# EAGLE schematic FinalSchematic1.2 (EAGLE 9.6.2)

## Sheet 1 of 6: Microcontroller
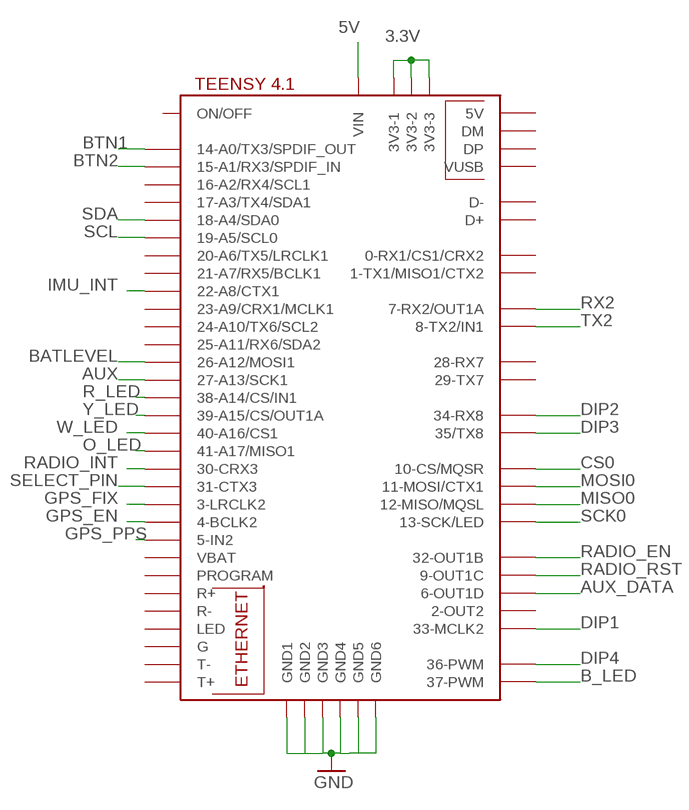
[diagram p0: schematic, sheet 1]

### Parts
TEENSY4.1  TEENSY41  [TEENSY41]

### Nets
3.3V: TEENSY4.1.3V3-1 TEENSY4.1.3V3-2 TEENSY4.1.3V3-3 ; also sheet 3
5V: TEENSY4.1.VIN ; also sheet 2,3,4,5,6
AUX: TEENSY4.1.27-A13/SCK1 ; also sheet 5
AUX_DATA: TEENSY4.1.6-OUT1D
B_LED: TEENSY4.1.37-PWM ; also sheet 5
BATLEVEL: TEENSY4.1.26-A12/MOSI1 ; also sheet 3
BTN1: TEENSY4.1.14-A0/TX3/SPDIF_OUT ; also sheet 5
BTN2: TEENSY4.1.15-A1/RX3/SPDIF_IN ; also sheet 5
CS0: TEENSY4.1.10-CS\MQSR(10-CS/MQSR) ; also sheet 4
DIP1: TEENSY4.1.33-MCLK2 ; also sheet 5
DIP2: TEENSY4.1.34-RX8 ; also sheet 5
DIP3: TEENSY4.1.35-TX8(35/TX8) ; also sheet 5
DIP4: TEENSY4.1.36-PWM ; also sheet 5
GND: TEENSY4.1.GND1 TEENSY4.1.GND2 TEENSY4.1.GND3 TEENSY4.1.GND4 TEENSY4.1.GND5 TEENSY4.1.GND6 ; also sheet 2,3,4,5
GPS_EN: TEENSY4.1.4-BCLK2 ; also sheet 4
GPS_FIX: TEENSY4.1.3-LRCLK2 ; also sheet 4
GPS_PPS: TEENSY4.1.5-IN2 ; also sheet 4
IMU_INT: TEENSY4.1.22-A8/CTX1 ; also sheet 4
MISO0: TEENSY4.1.12-MISO/MQSL ; also sheet 4
MOSI0: TEENSY4.1.11-MOSI/CTX1 ; also sheet 4
O_LED: TEENSY4.1.41-A17/MISO1 ; also sheet 5
R_LED: TEENSY4.1.38-A14/CS/IN1 ; also sheet 5
RADIO_EN: TEENSY4.1.32-OUT1B ; also sheet 4
RADIO_INT: TEENSY4.1.30-CRX3 ; also sheet 4
RADIO_RST: TEENSY4.1.9-OUT1C ; also sheet 4
RX2: TEENSY4.1.7-RX2/OUT1A ; also sheet 4
SCK0: TEENSY4.1.13-SCK/LED ; also sheet 4
SCL: TEENSY4.1.19-A5/SCL0 ; also sheet 2,4,5,6
SDA: TEENSY4.1.18-A4/SDA0 ; also sheet 2,4,5,6
SELECT_PIN: TEENSY4.1.31-CTX3 ; also sheet 5
TX2: TEENSY4.1.8-TX2/IN1 ; also sheet 4
W_LED: TEENSY4.1.40-A16/CS1 ; also sheet 5
Y_LED: TEENSY4.1.39-A15/CS/OUT1A ; also sheet 5
Unconnected: TEENSY4.1.0-RX1/CS1/CRX2 TEENSY4.1.1-TX1/MISO1/CTX2 TEENSY4.1.2-OUT2 TEENSY4.1.16-A2/RX4/SCL1 TEENSY4.1.17-A3/TX4/SDA1 TEENSY4.1.20-A6/TX5/LRCLK1 TEENSY4.1.21-A7/RX5/BCLK1 TEENSY4.1.23-A9/CRX1/MCLK1 TEENSY4.1.24-A10/TX6/SCL2 TEENSY4.1.25-A11/RX6/SDA2 TEENSY4.1.28-RX7 TEENSY4.1.29-TX7 TEENSY4.1.+5V(5V) TEENSY4.1.D+ TEENSY4.1.D- TEENSY4.1.DM TEENSY4.1.DP TEENSY4.1.G TEENSY4.1.LED TEENSY4.1.ON/OFF TEENSY4.1.PROGRAM TEENSY4.1.R+ TEENSY4.1.R- TEENSY4.1.T+ TEENSY4.1.T- TEENSY4.1.VBAT TEENSY4.1.VUSB

## Sheet 2 of 6: Servo Driver
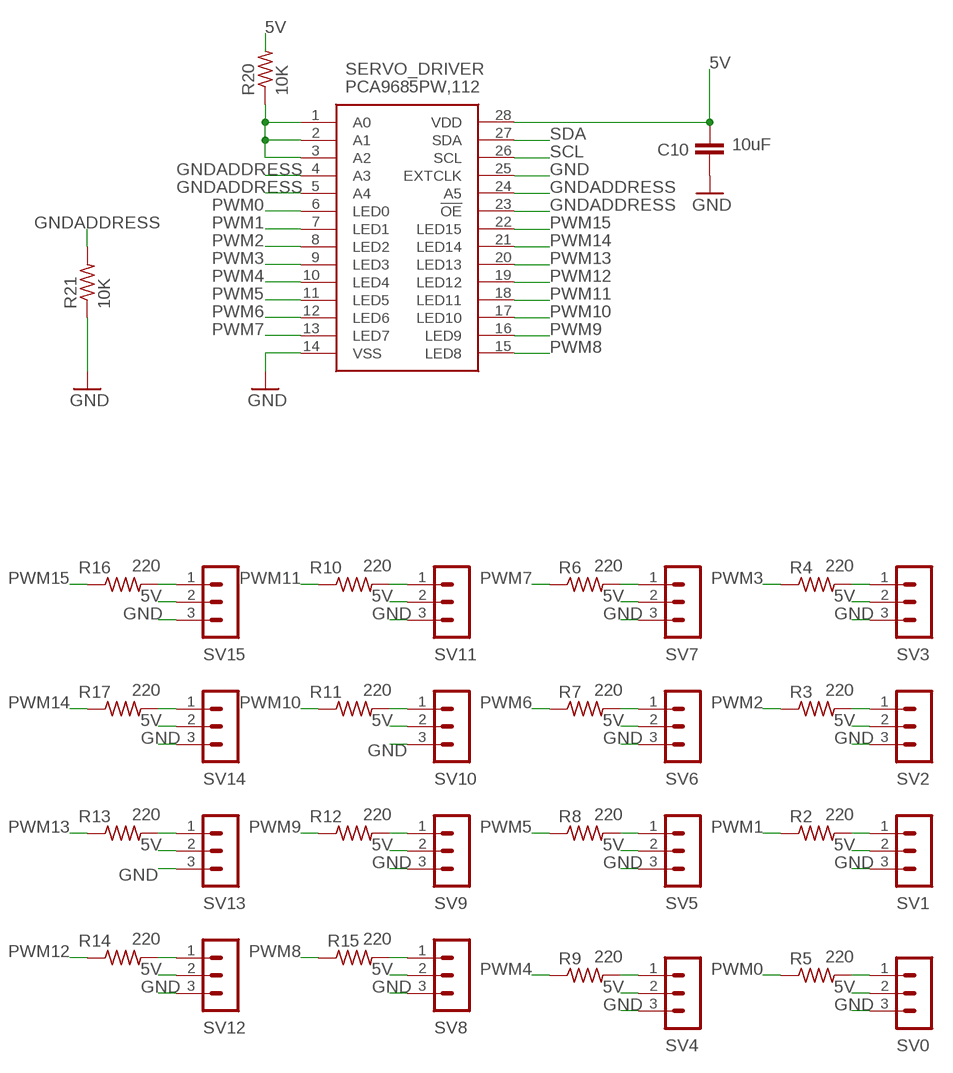
[diagram p1: schematic, sheet 2]

### Parts
C10  10uF  C2,5-3  [C2.5-3]
R2  220  R-US_0204/7  [0204/7]
R3  220  R-US_0204/7  [0204/7]
R4  220  R-US_0204/7  [0204/7]
R5  220  R-US_0204/7  [0204/7]
R6  220  R-US_0204/7  [0204/7]
R7  220  R-US_0204/7  [0204/7]
R8  220  R-US_0204/7  [0204/7]
R9  220  R-US_0204/7  [0204/7]
R10  220  R-US_0204/7  [0204/7]
R11  220  R-US_0204/7  [0204/7]
R12  220  R-US_0204/7  [0204/7]
R13  220  R-US_0204/7  [0204/7]
R14  220  R-US_0204/7  [0204/7]
R15  220  R-US_0204/7  [0204/7]
R16  220  R-US_0204/7  [0204/7]
R17  220  R-US_0204/7  [0204/7]
R20  10K  R-US_0204/7  [0204/7]
R21  10K  R-US_0204/7  [0204/7]
SERVO_DRIVER  PCA9685PW,112  [SOP65P640X110-28N]
SV0  MA03-1  [MA03-1]
SV1  MA03-1  [MA03-1]
SV2  MA03-1  [MA03-1]
SV3  MA03-1  [MA03-1]
SV4  MA03-1  [MA03-1]
SV5  MA03-1  [MA03-1]
SV6  MA03-1  [MA03-1]
SV7  MA03-1  [MA03-1]
SV8  MA03-1  [MA03-1]
SV9  MA03-1  [MA03-1]
SV10  MA03-1  [MA03-1]
SV11  MA03-1  [MA03-1]
SV12  MA03-1  [MA03-1]
SV13  MA03-1  [MA03-1]
SV14  MA03-1  [MA03-1]
SV15  MA03-1  [MA03-1]

### Nets
5V: C10.1 R20.2 SERVO_DRIVER.28(VDD) SV0.2 SV1.2 SV2.2 SV3.2 SV4.2 SV5.2 SV6.2 SV7.2 SV8.2 SV9.2 SV10.2 SV11.2 SV12.2 SV13.2 SV14.2 SV15.2 ; also sheet 1,3,4,5,6
GND: C10.2 R21.1 SERVO_DRIVER.14(VSS) SERVO_DRIVER.25(EXTCLK) SV0.3 SV1.3 SV2.3 SV3.3 SV4.3 SV5.3 SV6.3 SV7.3 SV8.3 SV9.3 SV10.3 SV11.3 SV12.3 SV13.3 SV14.3 SV15.3 ; also sheet 1,3,4,5
GNDADDRESS: R21.2 SERVO_DRIVER.4(A3) SERVO_DRIVER.5(A4) SERVO_DRIVER.23(!OE) SERVO_DRIVER.24(A5)
N$1: R20.1 SERVO_DRIVER.1(A0) SERVO_DRIVER.2(A1) SERVO_DRIVER.3(A2)
N$2: R14.2 SV12.1
N$43: R10.2 SV11.1
N$81: R6.2 SV7.1
N$82: R4.2 SV3.1
N$85: R3.2 SV2.1
N$88: R7.2 SV6.1
N$91: R11.2 SV10.1
N$94: R15.2 SV8.1
N$97: R2.2 SV1.1
N$100: R5.2 SV0.1
N$105: R9.2 SV4.1
N$108: R8.2 SV5.1
N$109: R12.2 SV9.1
N$112: R16.2 SV15.1
N$115: R17.2 SV14.1
N$118: R13.2 SV13.1
PWM0: R5.1 SERVO_DRIVER.6(LED0)
PWM1: R2.1 SERVO_DRIVER.7(LED1)
PWM2: R3.1 SERVO_DRIVER.8(LED2)
PWM3: R4.1 SERVO_DRIVER.9(LED3)
PWM4: R9.1 SERVO_DRIVER.10(LED4)
PWM5: R8.1 SERVO_DRIVER.11(LED5)
PWM6: R7.1 SERVO_DRIVER.12(LED6)
PWM7: R6.1 SERVO_DRIVER.13(LED7)
PWM8: R15.1 SERVO_DRIVER.15(LED8)
PWM9: R12.1 SERVO_DRIVER.16(LED9)
PWM10: R11.1 SERVO_DRIVER.17(LED10)
PWM11: R10.1 SERVO_DRIVER.18(LED11)
PWM12: R14.1 SERVO_DRIVER.19(LED12)
PWM13: R13.1 SERVO_DRIVER.20(LED13)
PWM14: R17.1 SERVO_DRIVER.21(LED14)
PWM15: R16.1 SERVO_DRIVER.22(LED15)
SCL: SERVO_DRIVER.26(SCL) ; also sheet 1,4,5,6
SDA: SERVO_DRIVER.27(SDA) ; also sheet 1,4,5,6

## Sheet 3 of 6: Voltage regulation
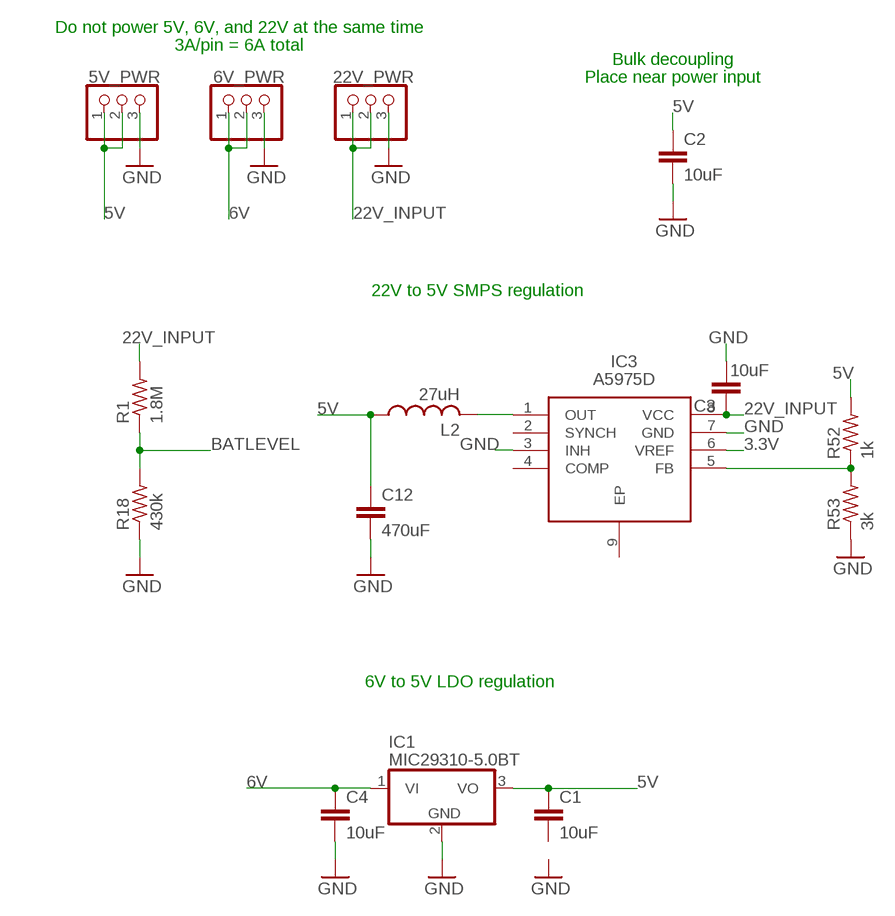
[diagram p2: schematic, sheet 3]

### Parts
5V_PWR  PINHD-1X3  [1X03]
6V_PWR  PINHD-1X3  [1X03]
22V_PWR  PINHD-1X3  [1X03]
C1  10uF  C2,5-3  [C2.5-3]
C2  10uF  C2,5-3  [C2.5-3]
C3  10uF  C2,5-3  [C2.5-3]
C4  10uF  C2,5-3  [C2.5-3]
C12  470uF  C2,5-3  [C2.5-3]
IC1  MIC29310-5.0BT  786TV  [TO220V]
IC3  A5975D  [SOIC127P600X170-9N]
L2  27uH  L-USTFI0307  [TFI0307]
R1  1.8M  R-US_0204/7  [0204/7]
R18  430k  R-US_0204/7  [0204/7]
R52  1k  R-US_0204/7  [0204/7]
R53  3k  R-US_0204/7  [0204/7]

### Nets
3.3V: IC3.6(VREF) ; also sheet 1
5V: 5V_PWR.1 5V_PWR.2 C1.1 C2.1 C12.1 IC1.3(VO) L2.1 R52.2 ; also sheet 1,2,4,5,6
6V: 6V_PWR.1 6V_PWR.2 C4.1 IC1.1(VI) ; also sheet 6
22V_INPUT: 22V_PWR.1 22V_PWR.2 C3.1 IC3.8(VCC) R1.2 ; also sheet 6
BATLEVEL: R1.1 R18.2 ; also sheet 1
GND: 5V_PWR.3 6V_PWR.3 22V_PWR.3 C2.2 C3.2 C4.2 C12.2 IC1.2(GND) IC3.3(INH) IC3.7(GND) R18.1 R53.1 ; also sheet 1,2,4,5
N$6: IC3.1(OUT) L2.2
N$18: IC3.5(FB) R52.1 R53.2
Unconnected: C1.2 IC3.2(SYNCH) IC3.4(COMP) IC3.9(EP)

### Notes on the sheet
- Do not power 5V, 6V, and 22V at the same time
- 3A/pin = 6A total
- Bulk decoupling
- Place near power input
- 22V to 5V SMPS regulation
- 6V to 5V LDO regulation

## Sheet 4 of 6: Sensors
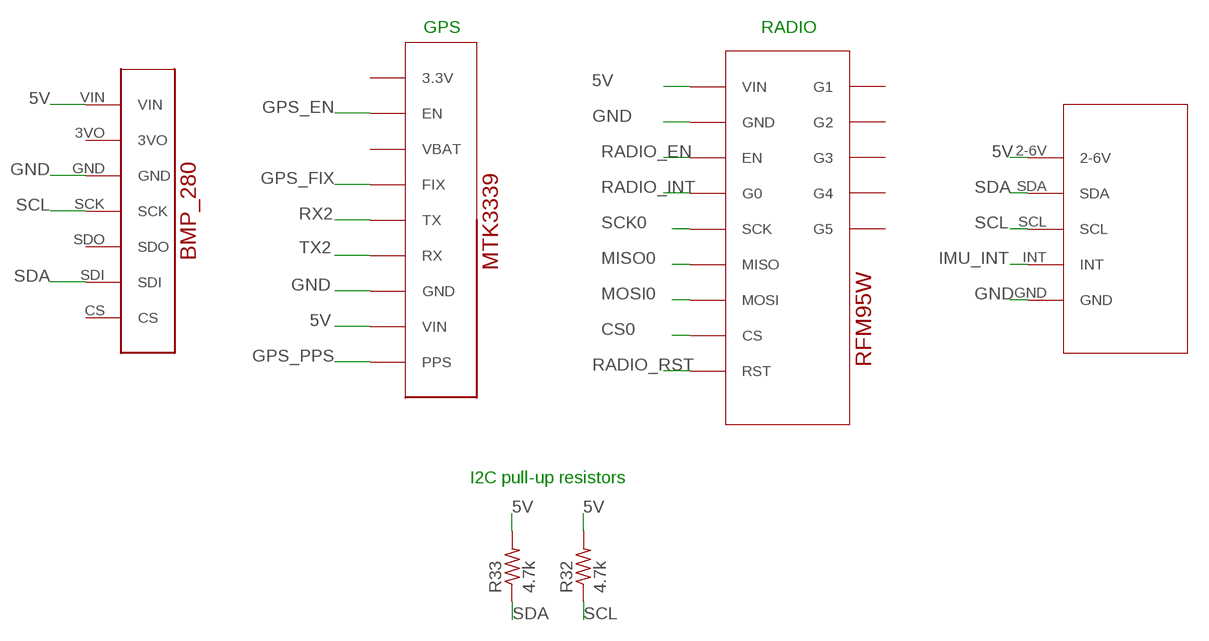
[diagram p3: schematic, sheet 4]

### Parts
GPSMTK3339  ADAFRUIT_MTK3339_GPS  [ADAFRUIT_MTK3339_GPS]
IMU  ICM20948BREAKOUTDEVICE  [ICM20948BREAKOUT]
R32  4.7k  R-US_0204/7  [0204/7]
R33  4.7k  R-US_0204/7  [0204/7]
RADIO  ADAFRUIT_RFM95W_LORA_RADIO  [ADAFRUIT_RFM95W_LORA_RADIO]
U1  ADAFRUIT_BMP280_BAROMETER  [ADAFRUIT_BMP280_BAROMETER]

### Nets
5V: GPSMTK3339.VIN IMU.2-6V R32.2 R33.2 RADIO.1(VIN) U1.VIN ; also sheet 1,2,3,5,6
CS0: RADIO.8(CS) ; also sheet 1
GND: GPSMTK3339.GND IMU.GND RADIO.2(GND) U1.GND ; also sheet 1,2,3,5
GPS_EN: GPSMTK3339.EN ; also sheet 1
GPS_FIX: GPSMTK3339.FIX ; also sheet 1
GPS_PPS: GPSMTK3339.PPS ; also sheet 1
IMU_INT: IMU.INT ; also sheet 1
MISO0: RADIO.6(MISO) ; also sheet 1
MOSI0: RADIO.7(MOSI) ; also sheet 1
RADIO_EN: RADIO.3(EN) ; also sheet 1
RADIO_INT: RADIO.4(G0) ; also sheet 1
RADIO_RST: RADIO.9(RST) ; also sheet 1
RX2: GPSMTK3339.TX ; also sheet 1
SCK0: RADIO.5(SCK) ; also sheet 1
SCL: IMU.SCL R32.1 U1.SCK ; also sheet 1,2,5,6
SDA: IMU.SDA R33.1 U1.SDI ; also sheet 1,2,5,6
TX2: GPSMTK3339.RX ; also sheet 1
Unconnected: GPSMTK3339.3.3V GPSMTK3339.VBAT RADIO.10(G1) RADIO.11(G2) RADIO.12(G3) RADIO.13(G4) RADIO.14(G5) U1.3VO U1.CS U1.SDO

### Notes on the sheet
- GPS | RADIO
- I2C pull-up resistors

## Sheet 5 of 6: External Connectors
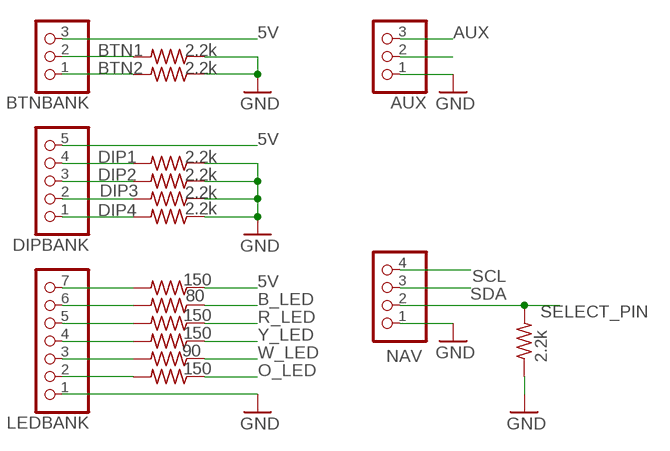
[diagram p4: schematic, sheet 5]

### Parts
AUX  PINHD-1X3  [1X03]
BLUE  80  R-US_0204/7  [0204/7]
BTNBANK  PINHD-1X3  [1X03]
DIPBANK  PINHD-1X5  [1X05]
GREEN  150  R-US_0204/7  [0204/7]
LEDBANK  PINHD-1X7  [1X07]
NAV  PINHD-1X4  [1X04]
ORANGE  150  R-US_0204/7  [0204/7]
R19  2.2k  R-US_0204/7  [0204/7]
R22  2.2k  R-US_0204/7  [0204/7]
R23  2.2k  R-US_0204/7  [0204/7]
R34  2.2k  R-US_0204/7  [0204/7]
R35  2.2k  R-US_0204/7  [0204/7]
R36  2.2k  R-US_0204/7  [0204/7]
R37  2.2k  R-US_0204/7  [0204/7]
RED  150  R-US_0204/7  [0204/7]
WHITE  90  R-US_0204/7  [0204/7]
YELLOW  150  R-US_0204/7  [0204/7]

### Nets
5V: BTNBANK.3 DIPBANK.5 GREEN.1 ; also sheet 1,2,3,4,6
AUX: AUX.3 ; also sheet 1
B_LED: BLUE.1 ; also sheet 1
BLUE: BLUE.2 LEDBANK.6
BTN1: BTNBANK.2 R19.2 ; also sheet 1
BTN2: BTNBANK.1 R22.2 ; also sheet 1
DIP1: DIPBANK.4 R37.2 ; also sheet 1
DIP2: DIPBANK.3 R36.2 ; also sheet 1
DIP3: DIPBANK.2 R34.2 ; also sheet 1
DIP4: DIPBANK.1 R35.2 ; also sheet 1
GND: AUX.1 LEDBANK.1 NAV.1 R19.1 R22.1 R23.1 R34.1 R35.1 R36.1 R37.1 ; also sheet 1,2,3,4
GREEN: GREEN.2 LEDBANK.7
N$4: AUX.2
O_LED: ORANGE.1 ; also sheet 1
ORANGE: LEDBANK.2 ORANGE.2
R_LED: RED.1 ; also sheet 1
RED: LEDBANK.5 RED.2
SCL: NAV.4 ; also sheet 1,2,4,6
SDA: NAV.3 ; also sheet 1,2,4,6
SELECT_PIN: NAV.2 R23.2 ; also sheet 1
W_LED: WHITE.1 ; also sheet 1
WHITE: LEDBANK.3 WHITE.2
Y_LED: YELLOW.1 ; also sheet 1
YELLOW: LEDBANK.4 YELLOW.2

## Sheet 6 of 6: Test Points
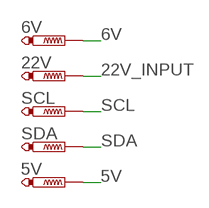
[diagram p5: schematic, sheet 6]

### Parts
5V  PTR1B1,27  [B1,27]
6V  PTR1B1,27  [B1,27]
22V  PTR1B1,27  [B1,27]
SCL  PTR1B1,27  [B1,27]
SDA  PTR1B1,27  [B1,27]

### Nets
5V: 5V.TP ; also sheet 1,2,3,4,5
6V: 6V.TP ; also sheet 3
22V_INPUT: 22V.TP ; also sheet 3
SCL: SCL.TP ; also sheet 1,2,4,5
SDA: SDA.TP ; also sheet 1,2,4,5

## Library data of the parts
5V 6V 22V SCL SDA = testpad:PTR1: TEST PIN
5V_PWR 6V_PWR 22V_PWR AUX BTNBANK = pinhead:PINHD-1X3: PIN HEADER
BLUE GREEN ORANGE R1-R23 R32-R37 R52 R53 RED WHITE YELLOW = adafruit:R-US_: RESISTOR, American symbol
C1-C4 C10 C12 = capacitor-wima:C: CAPACITOR naming: grid - package width
DIPBANK = pinhead:PINHD-1X5: PIN HEADER
GPSMTK3339 = AERO_Eagle_Library:ADAFRUIT_MTK3339_GPS: Adafruit's Ultimate GPS Breakout: MTK3339 https://www.adafruit.com/product/746
IC1 = linear:78*: Positive VOLTAGE REGULATOR Source: http://cache.national.com/ds/LM/LM78L05.pdf http://www.fairchildsemi.com/ds/LM/LM7805.pdf
IC3 = A5975D:A5975D: STMICROELECTRONICS - A5975D - DC/DC Boost Regulator, Adjustable, AEC-Q100, 4V to 36V In, 1.235V to 35V/3A Out, 250 kHz, PowerSO-8 Source: Datasheet <https://www.st.com/resource/en/datasheet/a5975d.pdf>; ARROW_PART_NUMBER: A5975D; ARROW_PRICE-STOCK: https://www.arrow.com/en/products/a5975d/stmicroelectronics; DESCRIPTION: STMICROELECTRONICS - A5975D - DC/DC Boost Regulator, Adjustable, AEC-Q100, 4V to 36V In, 1.235V to 35V/3A Out, 250 kHz, PowerSO-8; HEIGHT: 1.7mm; MANUFACTURER_NAME: STMicroelectronics; MANUFACTURER_PART_NUMBER: A5975D; MOUSER_PART_NUMBER: 511-A5975D; MOUSER_PRICE-STOCK: https://www.mouser.co.uk/ProductDetail/STMicroelectronics/A5975D?qs=LYO3r17CQdO66PebjUe%2FOA%3D%3D
IMU = ICM20948 BREAKOUT:ICM20948BREAKOUTDEVICE; SPICEPREFIX: X
L2 = rcl:L-US: INDUCTOR, American symbol; SPICEPREFIX: L
LEDBANK = pinhead:PINHD-1X7: PIN HEADER
NAV = pinhead:PINHD-1X4: PIN HEADER
RADIO = AERO_Eagle_Library:ADAFRUIT_RFM95W_LORA_RADIO: Adafruit's LoRa Radio: RFM95W https://www.adafruit.com/product/3072
SERVO_DRIVER = PCA9685PW_112:PCA9685PW,112: 16-channel, 12-bit PWM Fm+ I2C-bus LED controller Source: Datasheet <http://www.nxp.com/docs/en/data-sheet/PCA9685.pdf>; ARROW_PART_NUMBER: PCA9685PW,112; ARROW_PRICE-STOCK: https://www.arrow.com/en/products/pca9685pw112/nxp-semiconductors; DESCRIPTION: 16-channel, 12-bit PWM Fm+ I2C-bus LED controller; HEIGHT: 1.1mm; MANUFACTURER_NAME: NXP; MANUFACTURER_PART_NUMBER: PCA9685PW,112; MOUSER_PART_NUMBER: 771-PCA9685PW,112; MOUSER_PRICE-STOCK: https://www.mouser.co.uk/ProductDetail/NXP-Semiconductors/PCA9685PW112/?qs=6YAT8rHPFU9wZqiAeiOMZw%3D%3D
SV0 SV1-SV15 = con-lstb:MA03-1: PIN HEADER; OC_FARNELL: unknown; OC_NEWARK: unknown
TEENSY4.1 = teensy:TEENSY41
U1 = AERO_Eagle_Library:ADAFRUIT_BMP280_BAROMETER: Adafruit's Barometer: BMP280 https://www.adafruit.com/product/2651